# EAGLE design 1DD-17-test-board-mk-1.0 (EAGLE 7.5.0)
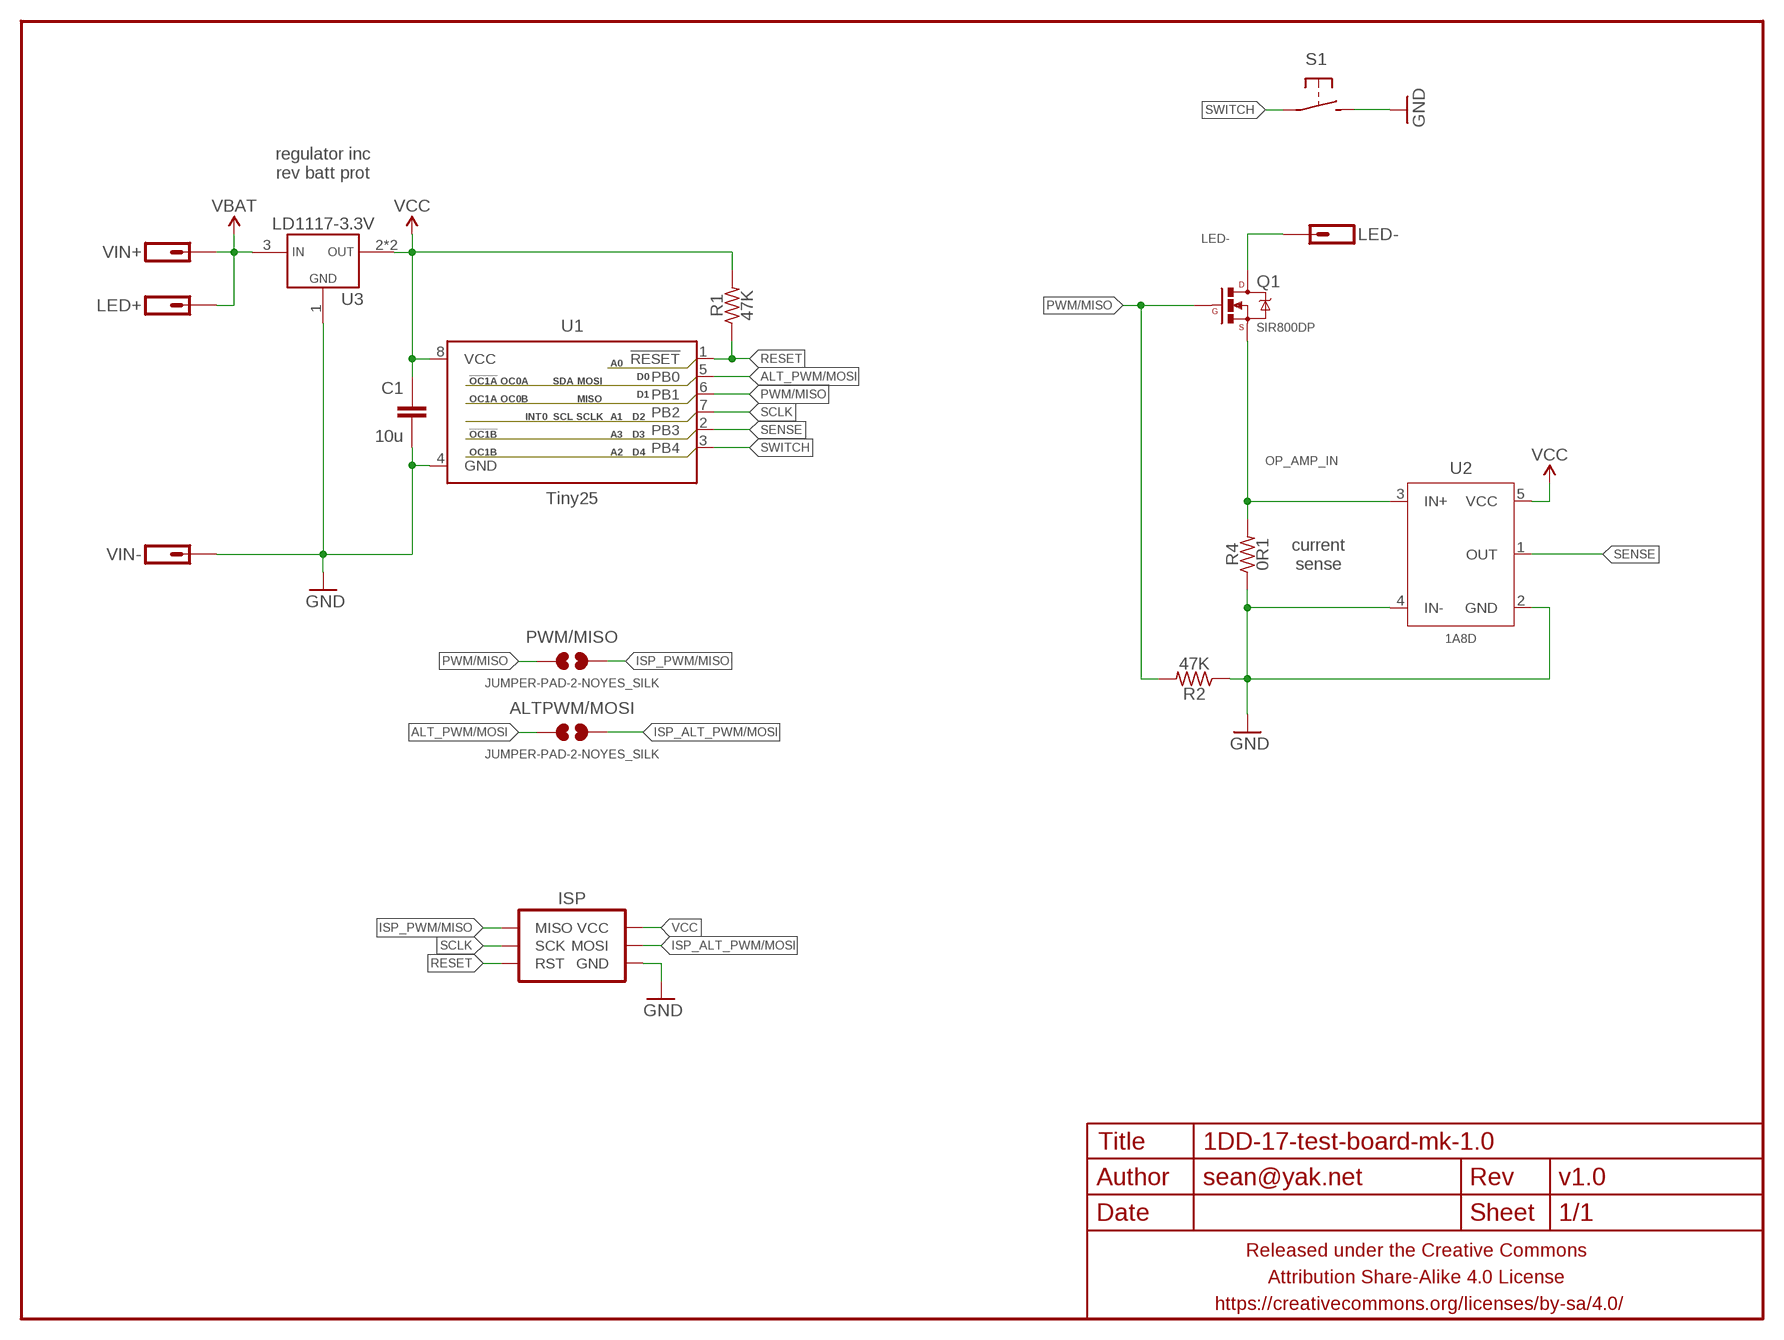
[diagram p0: schematic, sheet 1]

## Parts
ALTPWM/MOSI  JUMPER-PAD-2-NOYES_SILK  [PAD-JUMPER-2-NO_YES_SILK]
C1  10u  CAPACITOR-CERAMICC0805-TIGHTER  [C0805-TIGHTER]
FRAME1  FRAME-LETTERNO_PACKAGE  [DUMMY]
ISP  AVR_SPI_PRG_6PTH  [2X3]
LED+  M01OFFSET  [1X01_OFFSET]
LED-  M01OFFSET  [1X01_OFFSET]
PWM/MISO  JUMPER-PAD-2-NOYES_SILK  [PAD-JUMPER-2-NO_YES_SILK]
Q1  SIR800DP  MOSFET-NCHANNELSIR800DP  [POWERPACK-SO-8]
R1  47K  RESISTORR0603-TIGHTER  [R0603-TIGHTER]
R2  47K  RESISTORR0603-TIGHTER  [R0603-TIGHTER]
R4  0R1  RESISTORR1206  [R1206]
S1  SPST-NO-TACT3MM-PTH-SMALL-PADS  [DTS-3-SMALL-PADS]
U1  Tiny25  ATTINY13SOIC-NARROWPADS  [SO08-NARROWER]
U2  1A8D  INA180DBV-ALT  [SOT23-5-SLIM]
U3  LD1117-3.3V  VREG_1117SOT223  [SOT223]
VIN+  M01OFFSET  [1X01_OFFSET]
VIN-  M01OFFSET  [1X01_OFFSET]

## Nets
ALT_PWM/MOSI: ALTPWM/MOSI.1 U1.5(PB0)
GND: C1.2 ISP.6(GND) R2.1 R4.1 S1.2 U1.4(GND) U2.2(GND) U2.4(IN-) U3.1(GND) VIN-.1
ISP_ALT_PWM/MOSI: ALTPWM/MOSI.2 ISP.4(MOSI)
ISP_PWM/MISO: ISP.1(MISO) PWM/MISO.2
LED-: LED-.1 Q1.5678(D)
OP_AMP_IN: Q1.1(S) Q1.2(S) Q1.3(S) R4.2 U2.3(IN+)
PWM/MISO: PWM/MISO.1 Q1.4(G) R2.2 U1.6(PB1)
RESET: ISP.5(RST) R1.1 U1.1(!RESET)
SCLK: ISP.3(SCK) U1.7(PB2)
SENSE: U1.2(PB3) U2.1(OUT)
SWITCH: S1.1 U1.3(PB4)
VBAT: LED+.1 U3.3(VIN) VIN+.1
VCC: C1.1 ISP.2(VCC) R1.2 U1.8(VCC) U2.5(VCC) U3.2(VOUT) U3.4(VOUT)

## Notes on the sheet
- regulator inc
  rev batt prot
- current
  sense

## Library data of the parts
ALTPWM/MOSI PWM/MISO = a_parts:JUMPER-PAD-2-NO
C1 = a_parts:CAPACITOR-CERAMIC: CAPACITOR, European symbol
FRAME1 = a_parts:FRAME-LETTER: Schematic Frame Standard 8.5x11 US Letter frame; DESIGNER: sean@yak.net; VERSION: v1.0
ISP = a_parts:AVR_SPI_PRG_6: AVR ISP 6 Pin This is the reduced ISP connector for AVR programming. Common on Arduino. This footprint will take up less PCB space and can be used with a 10-pin to 6-pin adapter such as SKU: BOB-08508 **Special note about "TEST_POINT" package. The stop mask is on the top side, so if you want your programming test points to be on the bottom of your board, make sure to place this package on the bottom side of the board. This also ensure that the orientation to program from the bottom side will be correct.
LED+ LED- VIN+ VIN- = a_parts:M01: Header 1 Standard 1-pin 0.1" header. Use with straight break away headers (SKU : PRT-00116), right angle break away headers (PRT-00553), swiss pins (PRT-00743), machine pins (PRT-00117), and female headers (PRT-00115).
Q1 = a_parts:MOSFET-NCHANNEL: Common NMOSFET Parts MFG P/N Store ID Prod ID FDD8780 TRANS-09984 SI7820DN TRANS-11055 FDS6630A IC-08089 2N7002PW TRANS-11151 FQP30N06L COM-10213 TRANS-10060 BSS123LT1G TRANS-08345 BSS138 TRANS-00830 BS170 2N7000
R1 R2 R4 = a_parts:RESISTOR: RESISTOR, American symbol
S1 = a_parts:SPST-NO-TACT
U1 = a_parts:ATTINY13: Atmel 8-pin 1kB flash uC
U2 = a_parts:INA180
U3 = a_parts:VREG_1117

## Board
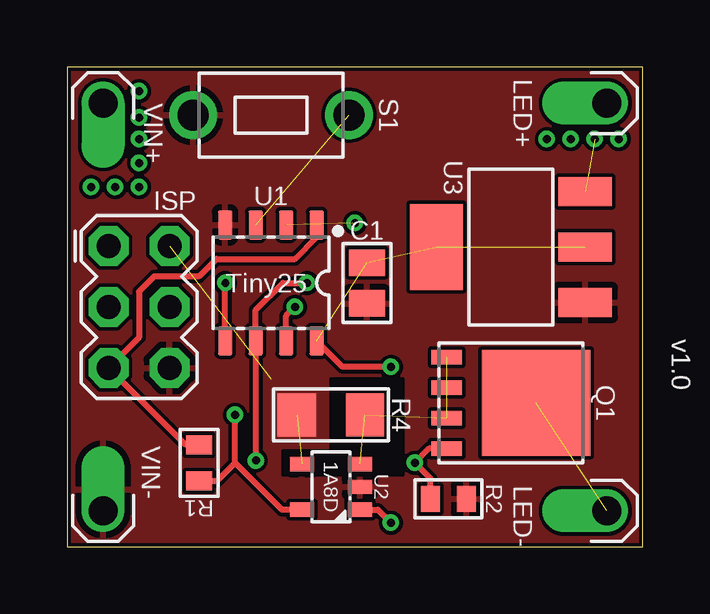
[diagram p1: board, top side]
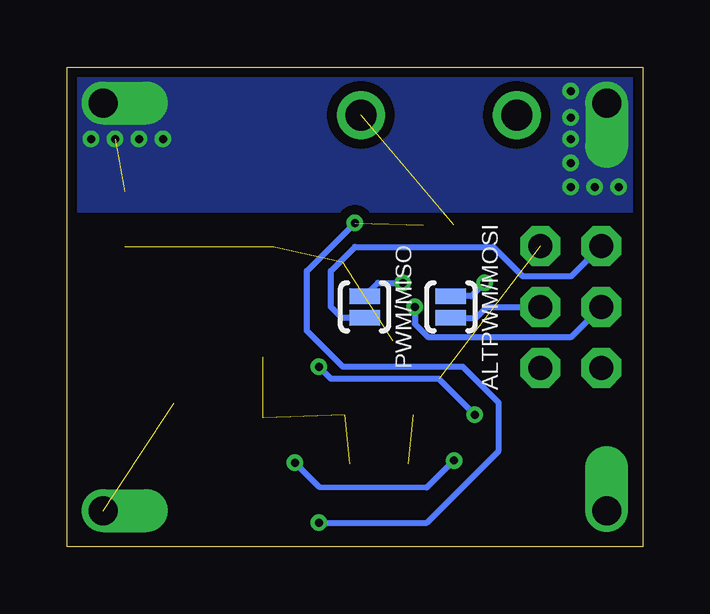
[diagram p2: board, bottom side, seen from below]

Size 24 x 20 mm. Coordinates in mm from the lower left corner, seen from the top.
Outline: 0,0 24,0 24,20 0,20 0,0
Copper layers (1*16): Top 0.0356mm / dielectric 1.5011mm / Bottom 0.0356mm
Design rules "LaenPCBOrder2 *": minimum track width 6mil, minimum drill 13mil, track to track 6mil, track to pad 6mil, pad to pad 6mil, via to via 6mil, smd to smd 6mil, copper to edge 6mil, drill to drill 6mil, minimum pad ring 7mil, minimum via ring 7mil, stop-mask expansion 3mil, vias tented up to drill 20mil, thermal gap 10mil

### Footprints (pad centres in the part's own frame; a part is rotated, then mirrored left to right if it is on the bottom)
PAD-JUMPER-2-NO_YES_SILK = smd 0.635 x 1.27: 1 -0.45,0; 2 0.45,0
C0805-TIGHTER = smd 1.1 x 1.5: 1 -0.85,0; 2 0.85,0
2X3 = drill 1 pad 1.676 octagon: 1 -2.54,-1.27; 2 -2.54,1.27; 3 0,-1.27; 4 0,1.27; 5 2.54,-1.27; 6 2.54,1.27
1X01_OFFSET = drill 1.2 pad 1.778 offset: 1 0,0
POWERPACK-SO-8 = smd 1.27 x 0.61: 1 -2.67,1.905; 2 -2.67,0.635; 3 -2.67,-0.635; 4 -2.67,-1.905 | smd 4.52 x 4.42: 5678 1.045,0
R0603-TIGHTER = smd 0.8 x 1.1: 1 -0.75,0; 2 0.75,0
R1206 = smd 1.6 x 1.8: 1 -1.42,0; 2 1.42,0
DTS-3-SMALL-PADS = drill 1.3 pad 2: 1 -3.25,0; 2 3.25,0
SO08-NARROWER = smd 0.6 x 1.2: 1 -1.905,-2.416; 2 -0.635,-2.416; 3 0.635,-2.416; 4 1.905,-2.416; 5 1.905,2.416; 6 0.635,2.416; 7 -0.635,2.416; 8 -1.905,2.416
SOT23-5-SLIM = smd 0.6 x 1: 1 -0.95,-1.2; 2 0,-1.2; 3 0.95,-1.2; 4 0.95,1.2; 5 -0.95,1.2
SOT223 = smd 1.219 x 2.235: 1 -2.311,-3.099; 2 0,-3.099; 3 2.311,-3.099 | smd 3.6 x 2.2: 4 0,3.099

### Placement (x,y rotation side)
ALTPWM/MOSI  8,10 270 bottom
C1  12.5,11 270 top
FRAME1  0,0 0 top
ISP  3,10 270 top
LED+  22.5,18.5 90 top
LED-  22.5,1.5 90 top
PWM/MISO  11.6,10 270 bottom
Q1  18.5,6 0 top
R1  5.5,3.5 270 top
R2  15.9,2 180 top
R4  11,5.5 0 top
S1  8.5,18 180 top
U1  8.5,11 180 top
U2  11,2.5 90 top
U3  18.5,12.5 90 top
VIN+  1.5,18.5 180 top
VIN-  1.5,1.5 0 top

### Tracks (layer width: path | path; a pad name or v marks a point on that pad's centre or on a via)
ALT_PWM/MOSI  (via drill 0.33)
  Top 0.25: U1.5 v6.59,11
  Bottom 0.25: v6.59,11 7.14,10.45 ALTPWM/MOSI.1
GND  (1 unrouted)
  pour Top (isolate 0.152, rank 6): 24,0 24,20 0,20 0,0
  cutout Top (isolate 0.152, no thermals): 11,7 11,4 9,4 9,3 14,3 14,7
  pour Top (isolate 0.152, no thermals): 8,7 8,4 11,4 11,7
ISP_ALT_PWM/MOSI
  Bottom 0.25: ALTPWM/MOSI.2 6.95,9.55 6.5,10 ISP.4
ISP_PWM/MISO
  Bottom 0.25: PWM/MISO.2 12.55,9.55 13,10 13,11.5 12,12.5 6.23,12.5 5,11.27 3,11.27 ISP.1
LED-  (1 unrouted)
OP_AMP_IN  (4 unrouted)
PWM/MISO  (via drill 0.33)
  Top 0.25: Q1.4 15.1,4.09 v14.5,3.5 15.15,2.85 R2.2 | v10,11 9,11 7.87,9.87 U1.6 v7.87,3.6
  Bottom 0.25: v14.5,3.5 13.5,2.5 9,2.47 v7.87,3.6 | PWM/MISO.1 11.05,11 v10,11
RESET
  Top 0.25: U1.1 10.4,12.9 9.5,12 6.23,12 5.5,11.27 3.63,11.27 3,10.63 3,8.73 ISP.5 4.94,4.25 R1.1
SCLK  (via drill 0.33)
  Top 0.25: U1.7 9.13,9.63 v9.5,10
  Bottom 0.25: v9.5,10 9.5,9.3 8.93,8.73 3,8.73 ISP.3
SENSE  (via drill 0.33)  (1 unrouted)
  Top 0.25: U2.1 12.95,1.55 v13.5,1
  Bottom 0.25: v13.5,1 9,1 6,4 6,6 7.5,7.5 12.5,7.5 14,9 14,11.5 v12,13.5
SWITCH  (1 unrouted)
VBAT  (via drill 0.33)  (1 unrouted)
  other vias: 1,15 2,15 3,15 3,16 3,17 3,17.9 3,19 20,17 21,17 22,17 23,17
  pour Bottom (isolate 0.406, no thermals): 0,20 24,20 24,14 0,14
VCC  (via drill 0.33)  (4 unrouted)
  Top 0.25: R1.2 6.25,2.75 7,3.5 | 7,3.5 v7,5.5 | v13.5,7.5 11.49,7.5 U1.8 | U2.5 8.95,1.55 7,3.5
  Bottom 0.25: v7,5.5 8.5,7 13,7 v13.5,7.5

### Text on the board
tPlace: 1DD-17 Test